# Altium schematic sheet adapter_sch.SchDoc
size A
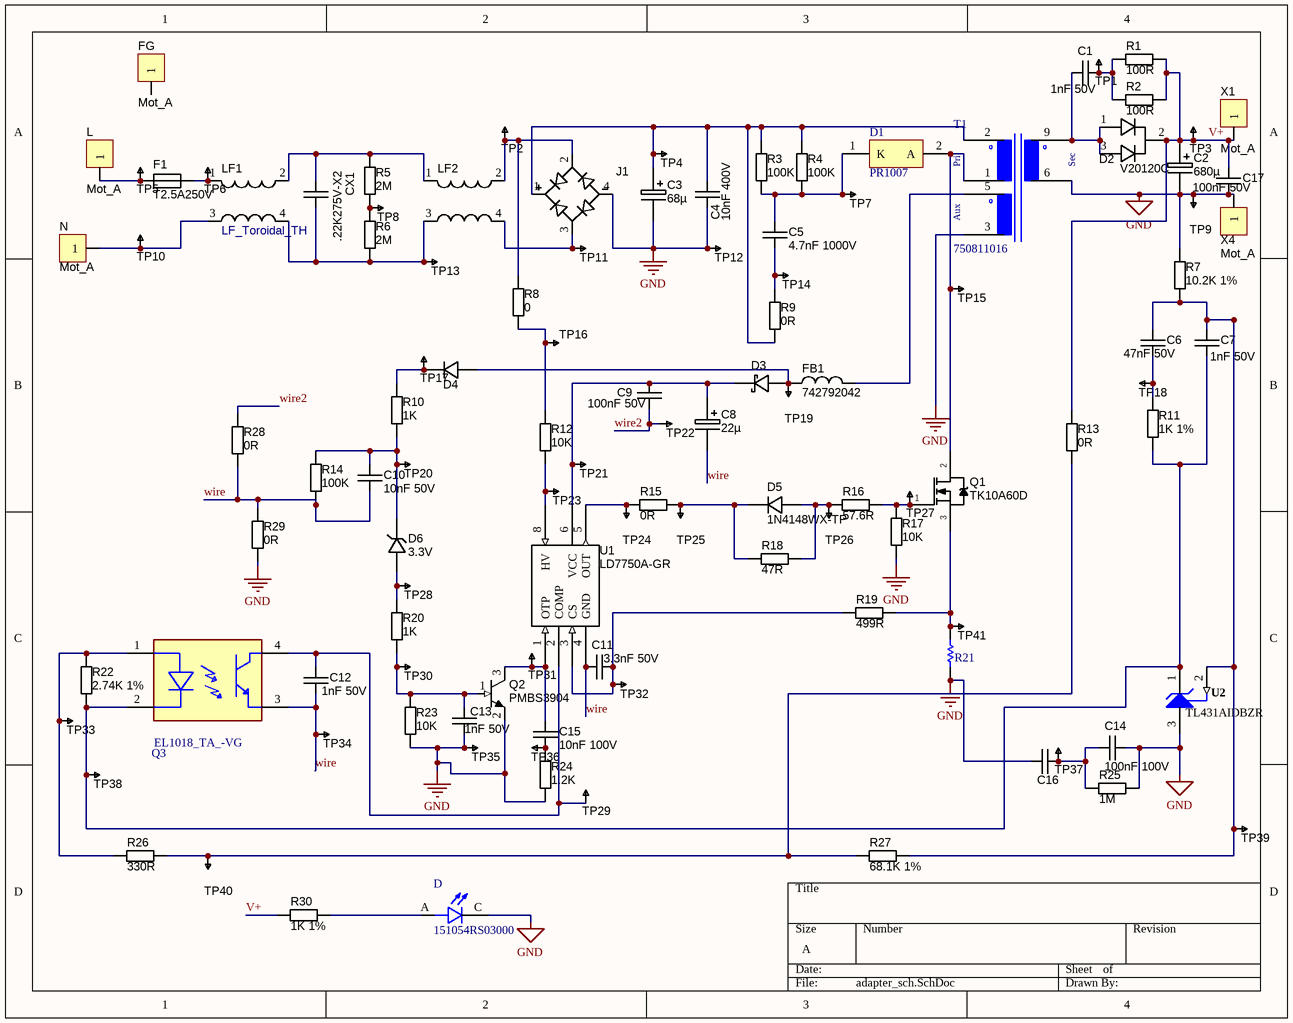
[diagram p0: adapter_sch.SchDoc]

## Parts
C1  value 1nF 50V  [CAPC2012X135N]  (hidden comment: approved sub OK)
C2  680µ  [CAPE4.7MM_Rad_10x17mm]
C3  68µ  [CAPAE400V68uF16X25]
C4  value 10nF 400V  [CAPC3216X180N]  (hidden comment: approved sub OK)
C5  value 4.7nF 1000V  [CAPC3216X180N]  (hidden comment: approved sub OK)
C6  47nF 50V  [CAPC1608X90N]
C7  1nF 50V  [CAPC1608X90N]
C8  22µ  [CAPE2MM_Rad_5x11mm]
C9  100nF 50V  [CAPC1608X90N]
C10  10nF 50V  [CAPC1608X90N]
C11  3.3nF 50V  [CAPC1608X90N]
C12  1nF 50V  [CAPC1608X90N]
C13  1nF 50V  [CAPC1608X90N]
C14  value 100nF 100V  [CAPC3216X180N]  (hidden comment: approved sub OK)
C15  10nF 100V  [CAPC1608X90N]
C16  (no value)  [CAPR9.5_CC]
C17  value 100nF 50V  [C0805]  (hidden comment: approved sub OK)
CX1  .22K275V-X2  [CAPMPF0.22K275V-X2_0.22UF]
D  151054RS03000  [LED_151054RS03000]
D1  PR1007  [DO-41 - Bended Radial]
D2  Manufacturer Part Number: V20120C  [DIODE_SCHOTTKY_V20120C_TH]  (hidden comment: DIODE_SCHOTTKY_V20120C_TH)
D3  DIODE_SCHOTTKY_10MQ100NPBF  [DO-214AC]  (value not drawn)
D4  100V; 1.5A  [SOD123]  (value not drawn)
D5  Manufacturer Part Number: 1N4148WX-TP  [SOD323]  (hidden comment: DIODE_75V_500mW)
D6  3.3V  [SOD323]
F1  value T2.5A250V  [FUSE_MST250]  (hidden comment: Radial Lead Micro Fuse, 2.5A)
FB1  Manufacturer Part Number 1: 742792042  [FBC2012N]  (hidden comment: 600R @ 100 MHz)
FG  Mot_A  [THP_D38_T75_B125]  (no BOM)
J1  100V; 1.5A  [BR_KBP208GL]  (value not drawn)
L  Mot_A  [THP_D38_T75_B125]  (no BOM)
LF1  LF_Toroidal_TH  [LF_Toroidal_TH]
LF2  LF_AC_Common_Mode_Ferrite_magnet_Coil  [LF_AC_Common_Mode_Ferrite_magnet_Coil]  (value not drawn)
N  Mot_A  [THP_D38_T75_B125]  (no BOM)
Q1  TK10A60D  [MOS_TK10A60E]
Q2  PMBS3904  [SOT23-3]
Q3  EL1018_TA_-VG  [SOP4_Everlight_EL101X-G_MFG]  (value not drawn)
R1  value 100R  [RESC3216X70N]  (hidden comment: RES_NL_1206)  (no BOM)
R2  value 100R  [RESC3216X70N]  (hidden comment: RES_NL_1206)  (no BOM)
R3  value 100K  [RESC3216X70N]  (hidden comment: RES_NL_1206)  (no BOM)
R4  value 100K  [RESC3216X70N]  (hidden comment: RES_NL_1206)  (no BOM)
R5  value 2M  [RESC3216X70N]  (hidden comment: RES_NL_1206)  (no BOM)
R6  value 2M  [RESC3216X70N]  (hidden comment: RES_NL_1206)  (no BOM)
R7  value 10.2K 1%  [RESC1608X55N]  (hidden comment: RES_NL_0603)  (no BOM)
R8  value 0  [RESC3216X70N]  (hidden comment: RES_NL_1206)  (no BOM)
R9  value 0R  [RESC3216N_ZERO]  (hidden comment: Thick Film)
R10  value 1K  [RESC1608X55N]  (hidden comment: RES_NL_0603)  (no BOM)
R11  value 1K 1%  [RESC1608X55N]  (hidden comment: RES_NL_0603)  (no BOM)
R12  value 10K  [RESC3216X70N]  (hidden comment: RES_NL_1206)  (no BOM)
R13  value 0R  [RESC2012N_ZERO]  (hidden comment: Jumper)
R14  value 100K  [RESC1608X55N]  (hidden comment: RES_NL_0603)  (no BOM)
R15  value 0R  [RESC2012X70N]  (hidden comment: Thick Film)
R16  value 57.6R  [AXIAL-0.6-17.5mm]  (hidden comment: Metal Film)
R17  value 10K  [RESC1608X55N]  (hidden comment: RES_NL_0603)  (no BOM)
R18  value 47R  [RESC2012X70N]  (hidden comment: RES_NL_0805)  (no BOM)
R19  value 499R  [RESC1608X55N]  (hidden comment: RES_NL_0603)  (no BOM)
R20  value 1K  [RESC2012X70N]  (hidden comment: RES_NL_0805)  (no BOM)
R21  Res_Com_radial_bended  [R1/4WD - p4.8]  (value not drawn)
R22  value 2.74K 1%  [RESC1608X55N]  (hidden comment: RES_NL_0603)  (no BOM)
R23  value 10K  [RESC1608X55N]  (hidden comment: RES_NL_0603)  (no BOM)
R24  value 1.2K  [RESC1608X55N]  (hidden comment: RES_NL_0603)  (no BOM)
R25  value 1M  [RESC3216X70N]  (hidden comment: RES_NL_1206)  (no BOM)
R26  value 330R  [RESC3216X70N]  (hidden comment: RES_NL_1206)  (no BOM)
R27  value 68.1K 1%  [RESC1608X55N]  (hidden comment: RES_NL_0603)  (no BOM)
R28  value 0R  [RESC3216X70N]  (hidden comment: Thick Film)
R29  value 0R  [RESC3216N_ZERO]  (hidden comment: Thick Film)
R30  value 1K 1%  [RESC1608X55N]  (hidden comment: RES_NL_0603)  (no BOM)
T1  750811016  [Transformer_THT_H_7PIN]
TP1  TESTPOINT  [TP-R60]  (value not drawn)  (no BOM)
TP2  TESTPOINT  [TP-R60]  (value not drawn)  (no BOM)
TP3  TESTPOINT  [TP-R60]  (value not drawn)  (no BOM)
TP4  TESTPOINT  [TP-R60]  (value not drawn)  (no BOM)
TP5  TESTPOINT  [TP-R60]  (value not drawn)  (no BOM)
TP6  TESTPOINT  [TP-R60]  (value not drawn)  (no BOM)
TP7  TESTPOINT  [TP-R60]  (value not drawn)  (no BOM)
TP8  TESTPOINT  [TP-R60]  (value not drawn)  (no BOM)
TP9  TESTPOINT  [TP-R60]  (value not drawn)  (no BOM)
TP10  TESTPOINT  [TP-R60]  (value not drawn)  (no BOM)
TP11  TESTPOINT  [TP-R60]  (value not drawn)  (no BOM)
TP12  TESTPOINT  [TP-R60]  (value not drawn)  (no BOM)
TP13  TESTPOINT  [TP-R60]  (value not drawn)  (no BOM)
TP14  TESTPOINT  [TP-R60]  (value not drawn)  (no BOM)
TP15  TESTPOINT  [TP-R60]  (value not drawn)  (no BOM)
TP16  TESTPOINT  [TP-R60]  (value not drawn)  (no BOM)
TP17  TESTPOINT  [TP-R60]  (value not drawn)  (no BOM)
TP18  TESTPOINT  [TP-R60]  (value not drawn)  (no BOM)
TP19  TESTPOINT  [TP-R60]  (value not drawn)  (no BOM)
TP20  TESTPOINT  [TP-R60]  (value not drawn)  (no BOM)
TP21  TESTPOINT  [TP-R60]  (value not drawn)  (no BOM)
TP22  TESTPOINT  [TP-R60]  (value not drawn)  (no BOM)
TP23  TESTPOINT  [TP-R60]  (value not drawn)  (no BOM)
TP24  TESTPOINT  [TP-R60]  (value not drawn)  (no BOM)
TP25  TESTPOINT  [TP-R60]  (value not drawn)  (no BOM)
TP26  TESTPOINT  [TP-R60]  (value not drawn)  (no BOM)
TP27  TESTPOINT  [TP-R60]  (value not drawn)  (no BOM)
TP28  TESTPOINT  [TP-R60]  (value not drawn)  (no BOM)
TP29  TESTPOINT  [TP-R60]  (value not drawn)  (no BOM)
TP30  TESTPOINT  [TP-R60]  (value not drawn)  (no BOM)
TP31  TESTPOINT  [TP-R60]  (value not drawn)  (no BOM)
TP32  TESTPOINT  [TP-R60]  (value not drawn)  (no BOM)
TP33  TESTPOINT  [TP-R60]  (value not drawn)  (no BOM)
TP34  TESTPOINT  [TP-R60]  (value not drawn)  (no BOM)
TP35  TESTPOINT  [TP-R60]  (value not drawn)  (no BOM)
TP36  TESTPOINT  [TP-R60]  (value not drawn)  (no BOM)
TP37  TESTPOINT  [TP-R60]  (value not drawn)  (no BOM)
TP38  TESTPOINT  [TP-R60]  (value not drawn)  (no BOM)
TP39  TESTPOINT  [TP-R60]  (value not drawn)  (no BOM)
TP40  TESTPOINT  [TP-R60]  (value not drawn)  (no BOM)
TP41  TESTPOINT  [TP-R60]  (value not drawn)  (no BOM)
U1  LD7750A-GR  [SOP7_LD7750AGR]
U2  TL431AIDBZR  [SOT23_L]
X1  Mot_A  [THP_D38_T75_B125]  (no BOM)
X4  Mot_A  [THP_D38_T75_B125]  (no BOM)

## Nets
GND: C2.2 C3.2 C4.2 C13.2 C14.2 C16.1 C17.1 D.C J1.4(NEG) Q2.2(E) R7.1 R17.2 R21.1 R23.2 R24.2 R25.2 R29.2 T1.3 T1.6 TP9.1 TP12.1 TP35.1 U2.3(ANODE) X4.1
V+: C2.1 C17.2 D2.2(K) R1.2 R2.2 R13.1 R30.1 TP3.1 X1.1
wire: C8.2 C10.2 C11.1 C12.2 Q3.3(E) R14.2 R28.2 R29.1 TP34.1 U1.4(GND)
wire2: C9.2 R28.1 TP22.1
NetC1_1: C1.1 D2.1(A) D2.3(A) T1.9
NetC1_2: C1.2 R1.1 R2.1 TP1.1
NetC3_1: C3.1 C4.1 J1.1(POS) R3.1 R4.1 R9.2 T1.2 TP4.1
NetC5_1: C5.1 D1.1(K) R3.2 R4.2 TP7.1
NetC5_2: C5.2 R9.1 TP14.1
NetC6_1: C6.1 C7.1 R7.2 R27.2 TP39.1 U2.2(REF)
NetC6_2: C6.2 R11.1 TP18.1
NetC7_2: C7.2 Q3.2(C) R11.2 R22.2 TP38.1 U2.1(CATHODE)
NetC8_1: C8.1 C9.1 D3.K TP21.1 U1.6(VCC)
NetC10_1: C10.1 D6.K R10.2 R14.1 TP20.1
NetC11_2: C11.2 R19.1 TP32.1 U1.3(CS)
NetC12_1: C12.1 Q3.4(C) TP29.1 U1.2(COMP)
NetC13_1: C13.1 Q2.1(B) R20.1 R23.1 TP30.1
NetC14_1: C14.1 C16.2 R25.1 TP37.1
NetC15_1: C15.1 Q2.3(C) TP31.1 U1.1(OTP)
NetC15_2: C15.2 R24.1 TP36.1
NetCX1_1: CX1.1 LF1.2 LF2.1 R5.1
NetCX1_2: CX1.2 LF1.4 LF2.3 R6.2 TP13.1
NetD1_2: D1.2(A) Q1.2(D) T1.1 TP15.1
NetD3_A: D3.A D4.A FB1.1 TP19.1
NetD4_K: D4.K R10.1 TP17.1
NetD5_A: D5.A R16.1 R18.2 TP26.1
NetD5_K: D5.K R15.1 R18.1 TP25.1
NetD6_A: D6.A R20.2 TP28.1
NetD_A: D.A R30.2
NetF1_1: F1.1 L.1 TP5.1
NetF1_2: F1.2 LF1.1 TP6.1
NetFB1_2: FB1.2 T1.5
NetJ1_2: J1.2(AC1) LF2.2 R8.1 TP2.1
NetJ1_3: J1.3(AC2) LF2.4 TP11.1
NetLF1_3: LF1.3 N.1 TP10.1
NetQ1_1: Q1.1(G) R16.2 R17.1 TP27.1
NetQ1_3: Q1.3(S) R19.2 R21.2 TP41.1
NetQ3_1: Q3.1(A) R22.1 R26.1 TP33.1
NetR5_2: R5.2 R6.1 TP8.1
NetR8_2: R8.2 R12.1 TP16.1
NetR12_2: R12.2 TP23.1 U1.8(HV)
NetR13_2: R13.2 R26.2 R27.1 TP40.1
NetR15_2: R15.2 TP24.1 U1.5(OUT)

Not connected (* = marked no-connect by the designer): FG 1

## Notes on the sheet
- (in symbol 750811016) Pri; Sec; Aux

## Library data of the parts
C1 C17 = CAPC_4u7_0805: Capacitor SMD Cer 4.7uF 10% 16V X5R 0805; Manufacturer 1: Taiyo Yuden; Manufacturer Part Number 1: EMK212BJ475KG-T; Ratings: 16V; X5R; Material: ceramic; SCDType: spec; Package / Case: 0805 (2012 Metric); Tolerance: ±10%; Supplier 1: Digi-Key; Supplier Part Number 1: 587-1294-1-ND; Operating Temperature: -55°C ~ 85°C; Size / Dimension: 0.079" L x 0.049" W (2.00mm x 1.25mm); Thickness (Max): 0.053" (1.35mm); ComponentLink1URL: http://www.yuden.co.jp/productdata/catalog/en/mlcc01_e.pdf; ComponentLink1Description: http://www.yuden.co.jp/productdata/catalog/en/mlcc01_e.pdf; Supplier 2: Digi-Key; Supplier Part Number 2: 1276-1065-1-ND; Manufacturer 2: Samsung Electro-Mechanics America, Inc; Manufacturer Part Number 2: CL21A475KOFNNNE; RoHS 2: RoHS Compliant; ComponentLink2URL: http://www.samsungsem.com/servlet/FileDownload?type=spec&file=CL21A475KOFNNNE.pdf; ComponentLink2Description: http://www.samsungsem.com/servlet/FileDownload?type=spec&file=CL21A475KOFNNNE.pdf; Supplier 3: Digi-Key; Supplier Part Number 3: 399-8101-1-ND; Manufacturer 3: Kemet; Manufacturer Part Number 3: C0805C475K4PACTU; RoHS 3: RoHS Compliant; ComponentLink3URL: http://capacitoredge.kemet.com/capedge2/DataSheet?pn=C0805C475K4PACTU; ComponentLink3Description: http://capacitoredge.kemet.com/capedge2/DataSheet?pn=C0805C475K4PACTU; Supplier 4: Digi-Key; Supplier Part Number 4: 490-7215-1-ND; Manufacturer 4: Murata Electronics North America; Manufacturer Part Number 4: GRM21BR61C475MA88L; RoHS 4: RoHS Compliant; ComponentLink4URL: http://psearch.murata.com/capacitor/product/GRM21BR61C475MA88#.pdf; ComponentLink4Description: http://psearch.murata.com/capacitor/product/GRM21BR61C475MA88#.pdf; Supplier 5: Digi-Key; Supplier Part Number 5: 445-7640-1-ND; Manufacturer 5: TDK Corporation; Manufacturer Part Number 5: C2012X5R1C475K125AC; RoHS 5: RoHS Compliant; ComponentLink5URL: http://product.tdk.com/capacitor/mlcc/en/documents/mlcc_commercial_general_en.pdf; ComponentLink5Description: http://product.tdk.com/capacitor/mlcc/en/documents/mlcc_commercial_general_en.pdf; RoHS 1: RoHS Compliant
C2 = CAPE_680u_25V_THT: Capacitor THT Alum Elec 680uF 25V; Manufacturer 1: Panasonic - ECG; Manufacturer Part Number 1: EEU-ED2D330; Ratings: 200V; 105°C; Tolerance: ±20%; Material: Al; SCDType: undef; Package / Case: Radial; Supplier 1: Digi-Key; Supplier Part Number 1: P13523-ND; Value: 680µ
C3 = CAPE_68u_400V_THT: Capacitor THT Alum Elec 68uF 20% 400V; pin to pad: 1>2 2>1; Manufacturer 1: Panasonic - ECG; Manufacturer Part Number 1: EEU-ED2D330; Ratings: 200V; 105°C; Material: Al; SCDType: undef; Package / Case: Radial; Tolerance: ±20%; Supplier 1: Digi-Key; Supplier Part Number 1: P13523-ND; Value: 68µ
C4 C5 C14 = CAPC_10u_1206_16V: Capacitor SMD Cer 10uF 10% 16V X7R 1206; Manufacturer 1: Kemet; Manufacturer Part Number 1: C1206C106K4RACTU; Ratings: 16V; X7R; Material: ceramic; SCDType: spec; Package / Case: 1206 (3216 metric); Tolerance: ±10%; Supplier 1: Digi-Key; Supplier Part Number 1: 399-3525-1-ND
C6 C7 C9-C13 C15 = CAPC_10p_0603_NP0_1%_50V: Capacitor SMD Cer 10pF 5% 50V NP0 0603; Manufacturer 1: Murata Electronics North America; Manufacturer Part Number 1: GRM1885C1H100FA01J; Ratings: 50V; NP0; SCDType: spec; Tolerance: ±5%; Operating Temperature: -55°C ~ 125°C; Package / Case: 0603 (1608 Metric); Size / Dimension: 0.063" L x 0.032" W (1.60mm x 0.81mm); Thickness (Max): 0.035" (0.90mm); Supplier 1: Digi-Key; Supplier Part Number 1: GRM1885C1H100FA01J-ND
  C6: Value: 47nF 50V
  C7 C12 C13: Value: 1nF 50V
  C9: Value: 100nF 50V
  C10: Value: 10nF 50V
  C11: Value: 3.3nF 50V
  C15: Value: 10nF 100V
C8 = CAPE_22u_50V_THT: Capacitor THT Alum Elec 22uF 50V; Manufacturer 1: Panasonic - ECG; Manufacturer Part Number 1: EEU-ED2D330; Ratings: 200V; 105°C; Tolerance: ±20%; Material: Al; SCDType: undef; Package / Case: Radial; Supplier 1: Digi-Key; Supplier Part Number 1: P13523-ND; Value: 22µ
C16 = CAPC_4KVV_CR: Capacitor THD Ceramic 4KV; Manufacturer 1: Panasonic - ECG; Manufacturer Part Number 1: ECQ-E1474KF; Tolerance: ±10%; Ratings: 100V; Material: Metallized Polyester; SCDType: undef; Package / Case: 12.5L x 4.5T x 9.0H x 10.0mm Pitch; Supplier 1: Digi-Key; Supplier Part Number 1: EF1474-ND
CX1 = CAPMPF_22n_250V_MP: Safety Capacitor THD MP Film 22nF 10% 250V; Manufacturer 1: Panasonic - ECG; Manufacturer Part Number 1: ECQ-E2223KF; SCDType: undef; Package / Case: 12.0L x 5.5T x 9.0H x 10.0mm Pitch; Tolerance: ±10%; Ratings: 250V; Material: Metallized Polyester; Supplier 1: Digi-Key; Supplier Part Number 1: EF2223-ND; Value: .22K275V-X2
D = 151054RS03000: Red 623nm LED Indication - Discrete 1.9V Radial; MF: Wurth Electronics; Value: *; SnapEDA_Link: https://www.snapeda.com/parts/151054RS03000/Wurth%20Electronics%20Inc./view-part/609365/?ref=snap; Price: None; Availability: Unavailable; Package: Radial WÃ¼rth Elektronik; MP: 151054RS03000
D1 = PR1007: Fast Recovery Rectifier Diode, 2-Pin Axial_Lead, Pb-Free, Bulk Box; pin to pad: 1>K 2>A; Manufacturer: On Semiconductor; PartNumber: 1N4003FF; IFSM Max (A): 30; IO(rec) Max (A): 1; Type: Standard Recovery; VRRM Max (V): 200; DatasheetVersion: Rev. 13; PackageVersion: Rev. U, 02/2005; PackageReference: AXIAL_LEAD-2-59-10; PackageDescription: 2-Pin, Axial Lead, Diameter 2.35 mm; Supplier 1: Mouser; Supplier Part Number 1: 863-1N4003FF; Packing: Bulk Box; RoHS: TRUE; Mounting Technology: Through Hole; ComponentLink1Description: Manufacturer URL; ComponentLink1URL: http://www.onsemi.com/; ComponentLink2Description: Datasheet; ComponentLink2URL: http://www.onsemi.com/pub_link/Collateral/1N4001-D.PDF; ComponentLink3Description: Package Specification; ComponentLink3URL: http://www.onsemi.cn/pub_link/Collateral/59-10.PDF
D2 = DIODE_SCHOTTKY_V20120C_TH: SCHOTTKY RECTIFIER TO-220AB COMMON CATHODE THROUGH HOLE; Manufacturer: Micro Commercial Co; Ratings: 75V; 300mA; 0.5W; Material: Si; Diode Type: Standard; Value: Vf=1V @ 50mA; SCDType: source; Package / Case: SOD323; Supplier 1: Digi-Key; Supplier Part Number 1: 1N4148WXTPMSCT-ND
D3 = DIODE_SCHOTTKY_10MQ100NPBF: Diode Schottky SMD 100V 2A SMA; Manufacturer 1: Micro Commercial Co; Manufacturer Part Number 1: SS210-TP; Material: Si; Speed: Fast Recovery =< 500ns, > 200mA (Io); SCDType: source; Ratings: 100V; 2A; Package / Case: DO-214AC, SMA; Diode Type: Schottky; Mounting Type: Surface Mount; Supplier 1: Digi-Key; Supplier Part Number 1: SS210-TPMSCT-ND
D4 = DIODE_switching_SJ_SOD_1-3: surface mount switching diode L1N4148WT1G; Manufacturer 1: Diodes Inc; Manufacturer Part Number 1: SJ; Material: Si; Diode Type: Standard; Value: Vf = 1.15V @ 1.5A (Max); SCDType: source; Package / Case: DO-214AC, SMA; Ratings: 100V; 1.5A; Supplier 1: Digi-Key; Supplier Part Number 1: S2BA-FDICT-ND
D5 = DIODE_75V_500mW: Diode SMD 300mA 0.5W SOD323; Manufacturer: Micro Commercial Co; Ratings: 75V; 300mA; 0.5W; Material: Si; Diode Type: Standard; Value: Vf=1V @ 50mA; SCDType: source; Package / Case: SOD323; Supplier 1: Digi-Key; Supplier Part Number 1: 1N4148WXTPMSCT-ND
D6 = DIODE_ZENER_3V3_SOD323: Diode Zener SMD 3.3V 200mW SOD-323; Manufacturer 1: ON Semiconductor; Manufacturer Part Number 1: MM3Z3V3ST1G; Ratings: 3.3V; 0.2W; Vf=900mV @ 10mA; Material: Si; Tolerance: ±3%; SCDType: source; Package / Case: SOD-323; Diode Type: Zener; Supplier 1: Digi-Key; Supplier Part Number 1: MM3Z3V3ST1GOSCT-ND
F1 = FUSE_MST_2.5A_250V: Radial Lead Micro Fuse, 2.5A TH; Manufacturer 1: Cooper Bussmann; Manufacturer Part Number 1: 0603ESDA-TR1; Voltage - Working: 24V; Voltage - Clamping: 35V; SCDType: spec; Package / Case: 0603 (1608 metric); Supplier 1: Digi-Key; Supplier Part Number 1: 283-2535-1-ND; ComponentLink1URL: http://www.cooperindustries.com/content/dam/public/bussmann/Electronics/Resources/Data%20Sheets/Bus_Elx_DS_4082_0603ESDA-TR.pdf; ComponentLink1Description: http://www.cooperindustries.com/content/dam/public/bussmann/Electronics/Resources/Data%20Sheets/Bus_Elx_DS_4082_0603ESDA-TR.pdf
FB1 = FERRITE_WURTH_742792042: Ferrite bead Wurth 742792042 SMD 200mA 0805; Manufacturer 1: WURTH ELEKTRONIK; Ratings: 200 mA; 500 mOhm DC; Impedance @ Frequency: 600 Ohm @ 100MHz; DC Resistance (DCR): 500 mOhm Max; Filter Type: Differential Mode - Single; SCDType: source; Size / Dimension: 0.063" L x 0.031" W (1.60mm x 0.80mm); Current Rating: 200mA; Package / Case: 0805 (2012 Metric); Height (Max): 0.041" (1.05mm); Value: 600R @ 100 MHz; Supplier 1: Newark; Supplier Part Number 1: 08P2373; ComponentLink1URL: http://katalog.we-online.de/kataloge/eisos/media/pdf/742792042.pdf; ComponentLink1Description: http://katalog.we-online.de/kataloge/eisos/media/pdf/742792042.pdf
FG L N X1 X4 = Term1
J1 = BR_KBP208GL_TH: KBP208GL GLASS PASSIVATED BRIDGE RECTIFIER; Manufacturer 1: Diodes Inc; Diode Type: Standard; Value: Vf = 1.15V @ 1.5A (Max); SCDType: source; Package / Case: DO-214AC, SMA; Ratings: 100V; 1.5A; Material: Si; Supplier 1: Digi-Key; Supplier Part Number 1: S2BA-FDICT-ND
LF1 = LF_Toroidal_TH: Toroidal line filter common-mode choke TH; Manufacturer 1: Wurth Electronics Inc; Manufacturer Part Number 1: 744232222; Impedance: 2200 Ohm at 100 MHz; Ratings: 2.2k Ohms at 100MHz; SCDType: source; PackageDescription: SMD Inductor, 4-Leads, Body 1.8 x 3.4 mm; Supplier 1: Digi-Key; Supplier Part Number 1: 732-1474-1-ND; ComponentLink1URL: http://katalog.we-online.de/kataloge/eisos/media/pdf/744232222.pdf; ComponentLink1Description: 744232222 datasheet; Package / Case: Horizontal, 4 PC Pad; Height (Max): 0.083" (2.10mm)
LF2 = LF_AC_Common_Mode_Ferrite_magnet_Coil: AC Common Mode Ferrite magnet Chokes; Manufacturer 1: Wurth Electronics Inc; Manufacturer Part Number 1: 744232222; Impedance: 2200 Ohm at 100 MHz; Ratings: 2.2k Ohms at 100MHz; SCDType: source; PackageDescription: SMD Inductor, 4-Leads, Body 1.8 x 3.4 mm; Supplier 1: Digi-Key; Supplier Part Number 1: 732-1474-1-ND; ComponentLink1URL: http://katalog.we-online.de/kataloge/eisos/media/pdf/744232222.pdf; ComponentLink1Description: 744232222 datasheet; Package / Case: Horizontal, 4 PC Pad; Height (Max): 0.083" (2.10mm)
Q1 = MOSFET_N-CH_TK10A60D: MOSFET N-Channel Power Switching TH; Manufacturer 1: Renesas Electronics America; Ratings: 30V; 30A; SCDType: undef; Package / Case: 8-WDFN exposed pad; Supplier 1: QuadRep Northwest, Inc.; Supplier Part Number 1: RJK03M7DPA-00#J5A; ComponentLink1URL: http://documentation.renesas.com/doc/products/transistor/r07ds0773ej0110_rjk03m7dpa.pdf; ComponentLink1Description: http://documentation.renesas.com/doc/products/transistor/r07ds0773ej0110_rjk03m7dpa.pdf; Manufacturer Part Number 1: TK10A60D
Q2 = NPN_PMBS3904_PHILIPS: Transistor SMD NPN 40V 100mA 250mW SOT23; Manufacturer 1: Fairchild Semiconductor; Manufacturer Part Number 1: MMBT2222A; Ratings: 40V; 600mA; 250mW; Material: Si; SCDType: source; Package / Case: SOT-23; Mounting Type: Surface Mount; Supplier 1: Digi-Key; Supplier Part Number 1: MMBT2222AFSTR-ND; Manufacturer 2: NXP Semiconductors; Manufacturer Part Number 2: MMBT2222A; Supplier 2: Digi-Key; Supplier Part Number 2: 568-4509-2-ND; Value: PMBS3904
R1-R6 R8 R12 R25 R26 = RES_NL_1206: Resistor, SMD chip; Package / Case: 1206 (3216 metric)
R7 R10 R11 R14 R17 R19 R22-R24 R27 R30 = RES_NL_0603: Resistor, SMD chip; Package / Case: 0603 (1608 metric)
R9 R15 R28 R29 = RES_0R_1206: Resistor SMD chip 0.0 Ohm 0.25W 1206; Manufacturer 1: Vishay/Dale; Manufacturer Part Number 1: CRCW12060000Z0EA; Tolerance: ±5%; Ratings: 1/4W; SCDType: spec*\?; Package / Case: 1206 (3216 metric); Supplier 1: Digi-Key; Supplier Part Number 1: 541-0.0ECT-ND
R13 = RES_0R_0805: Resistor SMD chip 0.0 Ohm 0.125W 0805; Manufacturer 1: Samsung Electro-Mechanics America, Inc; Manufacturer Part Number 1: RC2012J000CS; Ratings: 1/8W; SCDType: spec; Tolerance: N/A; Package / Case: 0805 (2012 metric); Supplier 1: Digi-Key; Supplier Part Number 1: 1276-5466-6-ND; RoHS 1: RoHS Compliant; ComponentLink1URL: http://www.samsungsem.com/servlet/FileDownload?filename=productcatalog/pdf/Chip_Resistor.pdf; ComponentLink1Description: http://www.samsungsem.com/servlet/FileDownload?filename=productcatalog/pdf/Chip_Resistor.pdf; Supplier 2: Digi-Key; Supplier Part Number 2: RMCF0805ZT0R00DKR-ND; Manufacturer 2: Stackpole Electronics Inc; Manufacturer Part Number 2: RMCF0805ZT0R00; RoHS 2: RoHS Compliant; ComponentLink2URL: http://www.seielect.com/Catalog/SEI-RMCF_RMCP.pdf; ComponentLink2Description: http://www.seielect.com/Catalog/SEI-RMCF_RMCP.pdf; Supplier 3: Digi-Key; Supplier Part Number 3: 311-0.0ARDKR-ND; Manufacturer 3: Yageo; Manufacturer Part Number 3: RC0805JR-070RL; RoHS 3: RoHS Compliant; ComponentLink3URL: http://media.digikey.com/pdf/Data%20Sheets/Yageo%20PDFs/RC0805%20Pb%20Free.pdf; ComponentLink3Description: http://media.digikey.com/pdf/Data%20Sheets/Yageo%20PDFs/RC0805%20Pb%20Free.pdf; Supplier 4: Digi-Key; Supplier Part Number 4: P0.0ADKR-ND; Manufacturer 4: Panasonic Electronic Components; Manufacturer Part Number 4: ERJ-6GEY0R00V; RoHS 4: RoHS Compliant; ComponentLink4URL: http://industrial.panasonic.com/www-cgi/jvcr13pz.cgi?E+PZ+3+AOA0001+ERJ6GEY0R00V+7+WW; ComponentLink4Description: http://industrial.panasonic.com/www-cgi/jvcr13pz.cgi?E+PZ+3+AOA0001+ERJ6GEY0R00V+7+WW; Supplier 5: Digi-Key; Supplier Part Number 5: RHM0.0CPDKR-ND; Manufacturer 5: Rohm Semiconductor; Manufacturer Part Number 5: MCR10ERTJ000; RoHS 5: RoHS Compliant; ComponentLink5URL: http://rohmfs.rohm.com/en/products/databook/datasheet/passive/resistor/chip_resistor/mcr_g.pdf; ComponentLink5Description: http://rohmfs.rohm.com/en/products/databook/datasheet/passive/resistor/chip_resistor/mcr_g.pdf
R16 = RES_10R_Axial_1W_5%: Resistor THD 10 Ohm 1W 5% Metal Film; Manufacturer 1: Vishay/BC Components; Manufacturer Part Number 1: PR01000101009JR500; SCDType: spec; Tolerance: ±5%; Package / Case: 2.5x8.0mm DxL; Ratings: 1W; Supplier 1: Digi-Key; Supplier Part Number 1: PPC10W-1CT-ND
R18 R20 = RES_NL_0805: Resistor, SMD chip; Package / Case: 0805 (2012 metric)
R21 = Res_Com_radial_bended: 4.59K +/-0.5%; pin to pad: 1>2 2>1
T1 = 750811016: Flyback Converters For For AC/DC Converters SMPS Transformer 4500Vrms Isolation Through Hole; MF: Wurth Electronics; Package: Wurth Electronics; MP: 750811016; Value: *; Availability: Unavailable; Price: None; SnapEDA_Link: https://www.snapeda.com/parts/750811016/Wurth%20Electronics%20Midcom/view-part/2709313/?ref=snap
TP1-TP41 = TESTPOINT: SMD test pin
U1 = PWM_CONT_LD7750A-GR: PWM CONTROLLER LD7750AGR SOP-7; Manufacturer 1: ON Semiconductor; Manufacturer Part Number 1: CAT93C46YI-G; Format - Memory: EEPROMs - Serial; Memory Type: EEPROM; Memory Size: 1K (128 x 8 or 64 x 16); Speed: 2MHz; Interface: Microwire, 3-Wire Serial; Voltage - Supply: 1.8 V ~ 5.5 V; Rule: UNIONINDEX{}0[]SOLDERMASKEXPANSIONMODE{}None[]PASTEMASKEXPANSIONMODE{}None[]RULEKIND{}Clearance[]NETSCOPE{}DifferentNets[]LAYERKIND{}SameLayer[]NAME{}Schematic Clearance Constraint[]GAP{}9.5mil[]UNIT{}Imperial[]PcbType{}ProtelPcb; SCDType: spec; Supplier 1: Digi-Key; Supplier Part Number 1: CAT93C46YI-G-ND; Operating Temperature: -40°C ~ 85°C; Package / Case: 8-TSSOP; Supplier Device Package: 8-TSSOP; ComponentLink1URL: http://www.onsemi.com/pub_link/Collateral/CAT93C46-D.PDF; ComponentLink1Description: http://www.onsemi.com/pub_link/Collateral/CAT93C46-D.PDF
U2 = TL431AIDBZR: Adjustable Precision Shunt Regulator, 34 ppm / degC, 100 mA, -40 to 85 degC, 3-pin SOT-23 (DBZ), Green (RoHS & no Sb/Br); pin to pad: 1>2 2>3 3>1; Manufacturer: Texas Instruments; Iout/Iz(Max)(mA): 100; Initial Accuracy @ 25/deg C(%): 1; SubFamily: Shunt Voltage Reference; Min Iz for Regulation(uA): 600; VO Adj(Max)(V): 36; VO Adj(Min)(V): 2.495; Rating: Catalog; Temp Coeff(Max)(ppm/ degree C): 92; Temp Coeff(Typ)(ppm/ degree C): 34; Eco-Plan: Green (RoHS & no Sb/Br); PartNumber: TL431AIDBZR; ComponentLink1Description: Manufacturer URL; ComponentLink2Description: Datasheet; DatasheetVersion: SLVS543M; ComponentLink1URL: http://www.ti.com/; Code_JEDEC: TO-236; ComponentLink2URL: http://www.ti.com/general/docs/lit/getliterature.tsp?genericPartNumber=TL431A&fileType=pdf; PackageReference: DBZ3; ComponentLink3Description: Package Specification; PackageVersion: 4203227/B; Mounting Technology: Surface Mount; PackageDescription: 3-Pin Plastic Small Outline, Body 2.92 x 1.3 mm, Pitch 0.95 mm; ComponentLink3URL: http://www.ti.com/litv/pdf/mpds108a